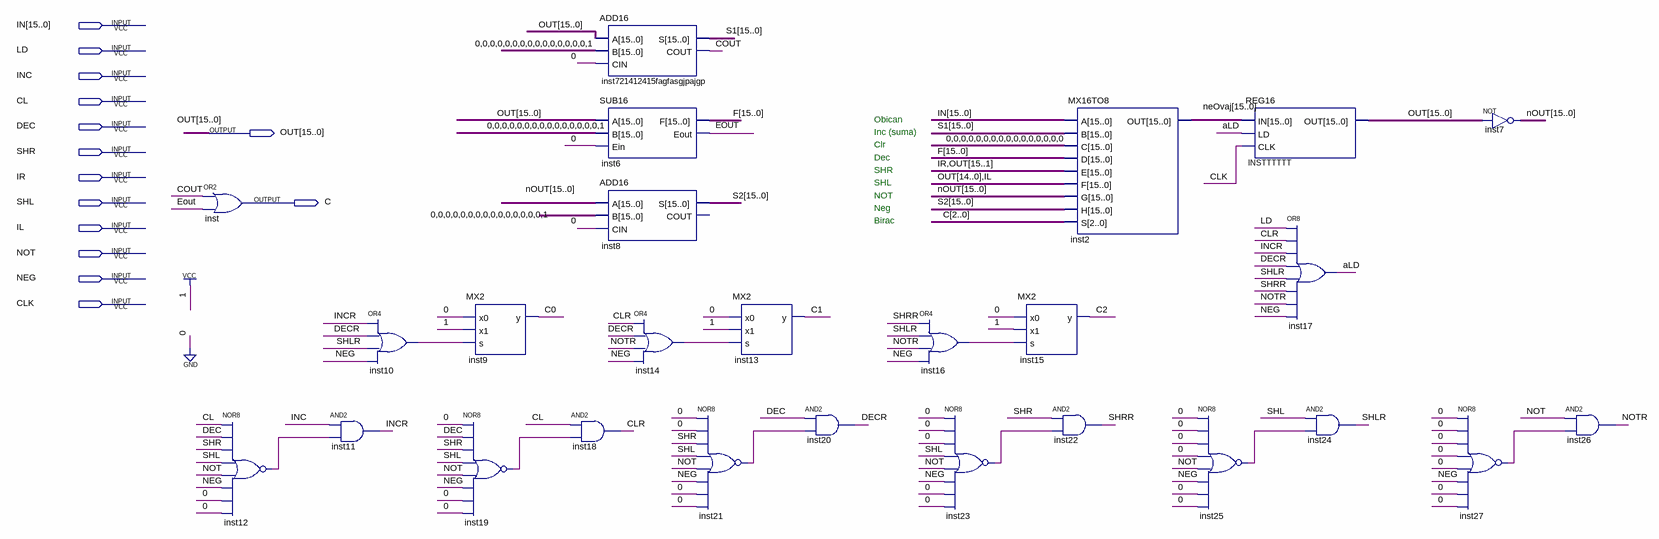
[diagram p0: schematic sheet]
// Quartus schematic REG16VER2.bdf as structural Verilog: 26 symbols, 14 pins
module REG16VER2 (
  input  [15:0] IN,
  input  LD,
  input  INC,
  input  CL,
  input  DEC,
  input  SHR,
  input  IR,
  input  SHL,
  input  IL,
  input  NOT,
  input  NEG,
  input  CLK,
  output [15:0] OUT,
  output C
);

  wire aLD, CLR, COUT, DECR, Eout, INCR, inst10_out, inst12_out, inst14_out, inst16_out, inst19_out,
       inst21_out, inst23_out, inst25_out, inst27_out, NOTR, SHLR, SHRR;
  wire [2:0] C_bus;
  wire [15:0] F, neOvaj, nOUT, S1, S2;

  or inst (C, COUT, Eout);
  nor inst12 (inst12_out, CL, DEC, SHR, SHL, NOT, NEG, 1'b0, 1'b0);
  or inst10 (inst10_out, INCR, DECR, SHLR, NEG);
  and inst11 (INCR, INC, inst12_out);
  MX2 inst9 (.x0(1'b0), .x1(1'b1), .s(inst10_out), .y(C_bus[0]));
  nor inst19 (inst19_out, 1'b0, DEC, SHR, SHL, NOT, NEG, 1'b0, 1'b0);
  and inst18 (CLR, CL, inst19_out);
  ADD16 inst721412415fagfasgjpajgp (.A(OUT), .B(16'b0000000000000001), .CIN(1'b0), .S(S1), .COUT(COUT));
  SUB16 inst6 (.A(OUT), .B(16'b0000000000000001), .Ein(1'b0), .F(F), .Eout(Eout));
  ADD16 inst8 (.A(nOUT), .B(16'b0000000000000001), .CIN(1'b0), .S(S2));  // open: COUT
  or inst14 (inst14_out, CLR, DECR, NOTR, NEG);
  nor inst21 (inst21_out, 1'b0, 1'b0, SHR, SHL, NOT, NEG, 1'b0, 1'b0);
  MX2 inst13 (.x0(1'b0), .x1(1'b1), .s(inst14_out), .y(C_bus[1]));
  and inst20 (DECR, DEC, inst21_out);
  or inst16 (inst16_out, SHRR, SHLR, NOTR, NEG);
  nor inst23 (inst23_out, 1'b0, 1'b0, 1'b0, SHL, NOT, NEG, 1'b0, 1'b0);
  MX2 inst15 (.x0(1'b0), .x1(1'b1), .s(inst16_out), .y(C_bus[2]));
  MX16TO8 inst2 (
    .A(IN), .B(S1), .C({16{1'b0}}), .D(F), .E({IR, OUT[15:1]}), .F({OUT[14:0], IL}), .G(nOUT), .H(S2),
    .S(C_bus), .OUT(neOvaj));
  and inst22 (SHRR, SHR, inst23_out);
  nor inst25 (inst25_out, 1'b0, 1'b0, 1'b0, 1'b0, NOT, NEG, 1'b0, 1'b0);
  REG16 INSTTTTTT (.IN(neOvaj), .LD(aLD), .CLK(CLK), .OUT(OUT));
  or inst17 (aLD, LD, CLR, INCR, DECR, SHLR, SHRR, NOTR, NEG);
  and inst24 (SHLR, SHL, inst25_out);
  assign nOUT = ~OUT;  // NOT inst7, 16 bits wide
  nor inst27 (inst27_out, 1'b0, 1'b0, 1'b0, 1'b0, 1'b0, NEG, 1'b0, 1'b0);
  and inst26 (NOTR, NOT, inst27_out);

  // Notes on the sheet:
  //   Obican
  //   Inc (suma)
  //   Clr
  //   Dec
  //   SHR
  //   SHL
  //   NOT
  //   Neg
  //   Birac
endmodule
